# Altium schematic sheet MCU.SchDoc
size A4; SheetNumber: 2; SheetTotal: 7
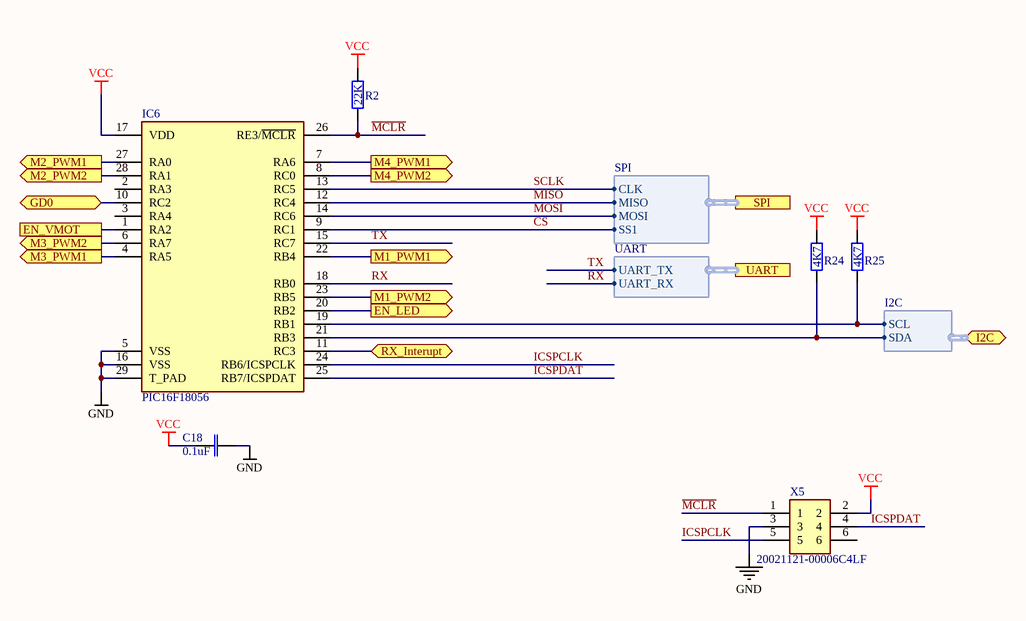
[diagram p0: MCU.SchDoc]

## Parts
C18  0.1uF  [CAP0402]
IC6  PIC16F18056  [QFN28_4X4(PIC16F18056)]
R2  22K  [RES0402]  (value not drawn)
R24  4K7  [RES0402]  (value not drawn)
R25  4K7  [RES0402]  (value not drawn)
X5  20021121-00006C4LF  [20021121-00X06CXLF]

## Ports
EN_LED (out), EN_VMOT, GD0 (bidir), I2C (bidir, harness I2C), M1_PWM1 (out), M1_PWM2 (out), M2_PWM1 (out), M2_PWM2 (out), M3_PWM1 (out), M3_PWM2 (out), M4_PWM1 (out), M4_PWM2 (out), RX_Interupt (bidir), SPI (harness SPI), UART (harness UART)

## Harnesses
SPI: MOSI, MISO, CLK, SS1
UART: UART_TX, UART_RX
I2C: SCL, SDA

## Nets
GND: C18.2 IC6.5(VSS) IC6.16(VSS) IC6.29(T_PAD) X5.3
VCC: C18.1 IC6.17(VDD) R2.2 R24.2 R25.2 X5.2
CS: IC6.9(RC1) ; port SPI.SS1
EN_LED: IC6.20(RB2) ; port EN_LED
EN_VMOT: IC6.1(RA2) ; port EN_VMOT
GD0: IC6.10(RC2) ; port GD0
ICSPCLK: IC6.24(RB6/ICSPCLK) X5.5
ICSPDAT: IC6.25(RB7/ICSPDAT) X5.4
M1_PWM1: IC6.22(RB4) ; port M1_PWM1
M1_PWM2: IC6.23(RB5) ; port M1_PWM2
M2_PWM1: IC6.27(RA0) ; port M2_PWM1
M2_PWM2: IC6.28(RA1) ; port M2_PWM2
M3_PWM1: IC6.4(RA5) ; port M3_PWM1
M3_PWM2: IC6.6(RA7) ; port M3_PWM2
M4_PWM1: IC6.7(RA6) ; port M4_PWM1
M4_PWM2: IC6.8(RC0) ; port M4_PWM2
~{MCLR}: IC6.26(RE3/~{MCLR}) R2.1 X5.1
MISO: IC6.12(RC4) ; port SPI.MISO
MOSI: IC6.14(RC6) ; port SPI.MOSI
RX: IC6.18(RB0) ; port UART.UART_RX
RX_Interupt: IC6.11(RC3) ; port RX_Interupt
SCLK: IC6.13(RC5) ; port SPI.CLK
TX: IC6.15(RC7) ; port UART.UART_TX
NetIC6_19: IC6.19(RB1) R25.1 ; port I2C.SCL
NetIC6_21: IC6.21(RB3) R24.1 ; port I2C.SDA

Not connected (* = marked no-connect by the designer): IC6 2(RA3) 3(RA4); X5 6

## Library data of the parts
C18 = CAP_0402: Manufacturer: Samsung Electro-Mechanics; Manufacturer Partnummber: CL05A104KA5NNNC; Value: 0.1uF
IC6 = PIC16F18056: Manufacturer: Microchip Technology; Manufacturer Partnummber: PIC16F18056-I/STX
R2 = RES_0402: Manufacturer: YAGEO; Manufacturer Partnummber: RC0402FR-0722KL; Value: 22K
R24 R25 = RES_0402: Manufacturer: YAGEO; Manufacturer Partnummber: RC0402FR-074K7L; Value: 4K7
X5 = 20021121-00006C4LF: Manufacturer: Amphenol ICC (FCI); JLCPCB Part #: C178291; Manufacturer Partnummber: 20021121-00006C4LF